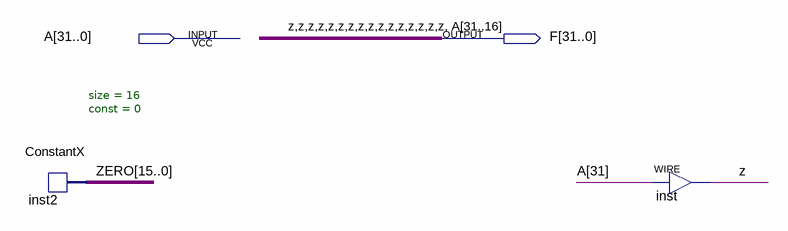
[diagram p0: schematic sheet]
// Quartus schematic int_real.bdf as structural Verilog: 2 symbols, 2 pins
module int_real (
  input  [31:0] A,
  output [31:0] F
);

  wire [15:0] ZERO;

  ConstantX #(.size(16), .\const (0)) inst2 (.DATA_OUT(ZERO));
  assign F[31] = A[31];  // WIRE inst

  assign F[30:0] = {{15{F[31]}}, A[31:16]};

  // Other names for the same wires on the sheet: z = F[31]
endmodule
